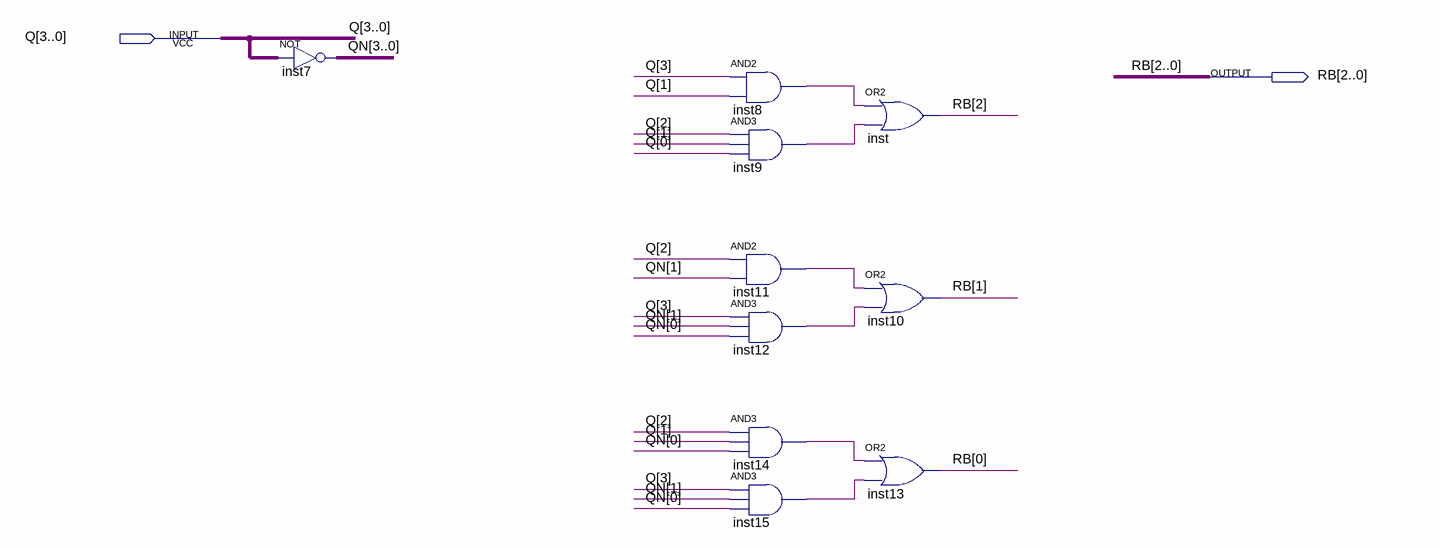
[diagram p0: schematic sheet]
// Quartus schematic RB.bdf as structural Verilog: 10 symbols, 2 pins
module RB (
  input  [3:0] Q,
  output [2:0] RB
);

  wire inst8_out, inst9_out, inst11_out, inst12_out, inst14_out, inst15_out;
  wire [3:0] QN;

  assign QN = ~Q;  // NOT inst7, 4 bits wide
  and inst8 (inst8_out, Q[3], Q[1]);
  and inst9 (inst9_out, Q[2], Q[1], Q[0]);
  and inst11 (inst11_out, Q[2], QN[1]);
  and inst12 (inst12_out, Q[3], QN[1], QN[0]);
  and inst14 (inst14_out, Q[2], Q[1], QN[0]);
  and inst15 (inst15_out, Q[3], QN[1], QN[0]);
  or inst (RB[2], inst8_out, inst9_out);
  or inst10 (RB[1], inst11_out, inst12_out);
  or inst13 (RB[0], inst14_out, inst15_out);
endmodule
